# Altium project AD7763EDZ_Rev_15.PrjPcb (part 1 of 2)
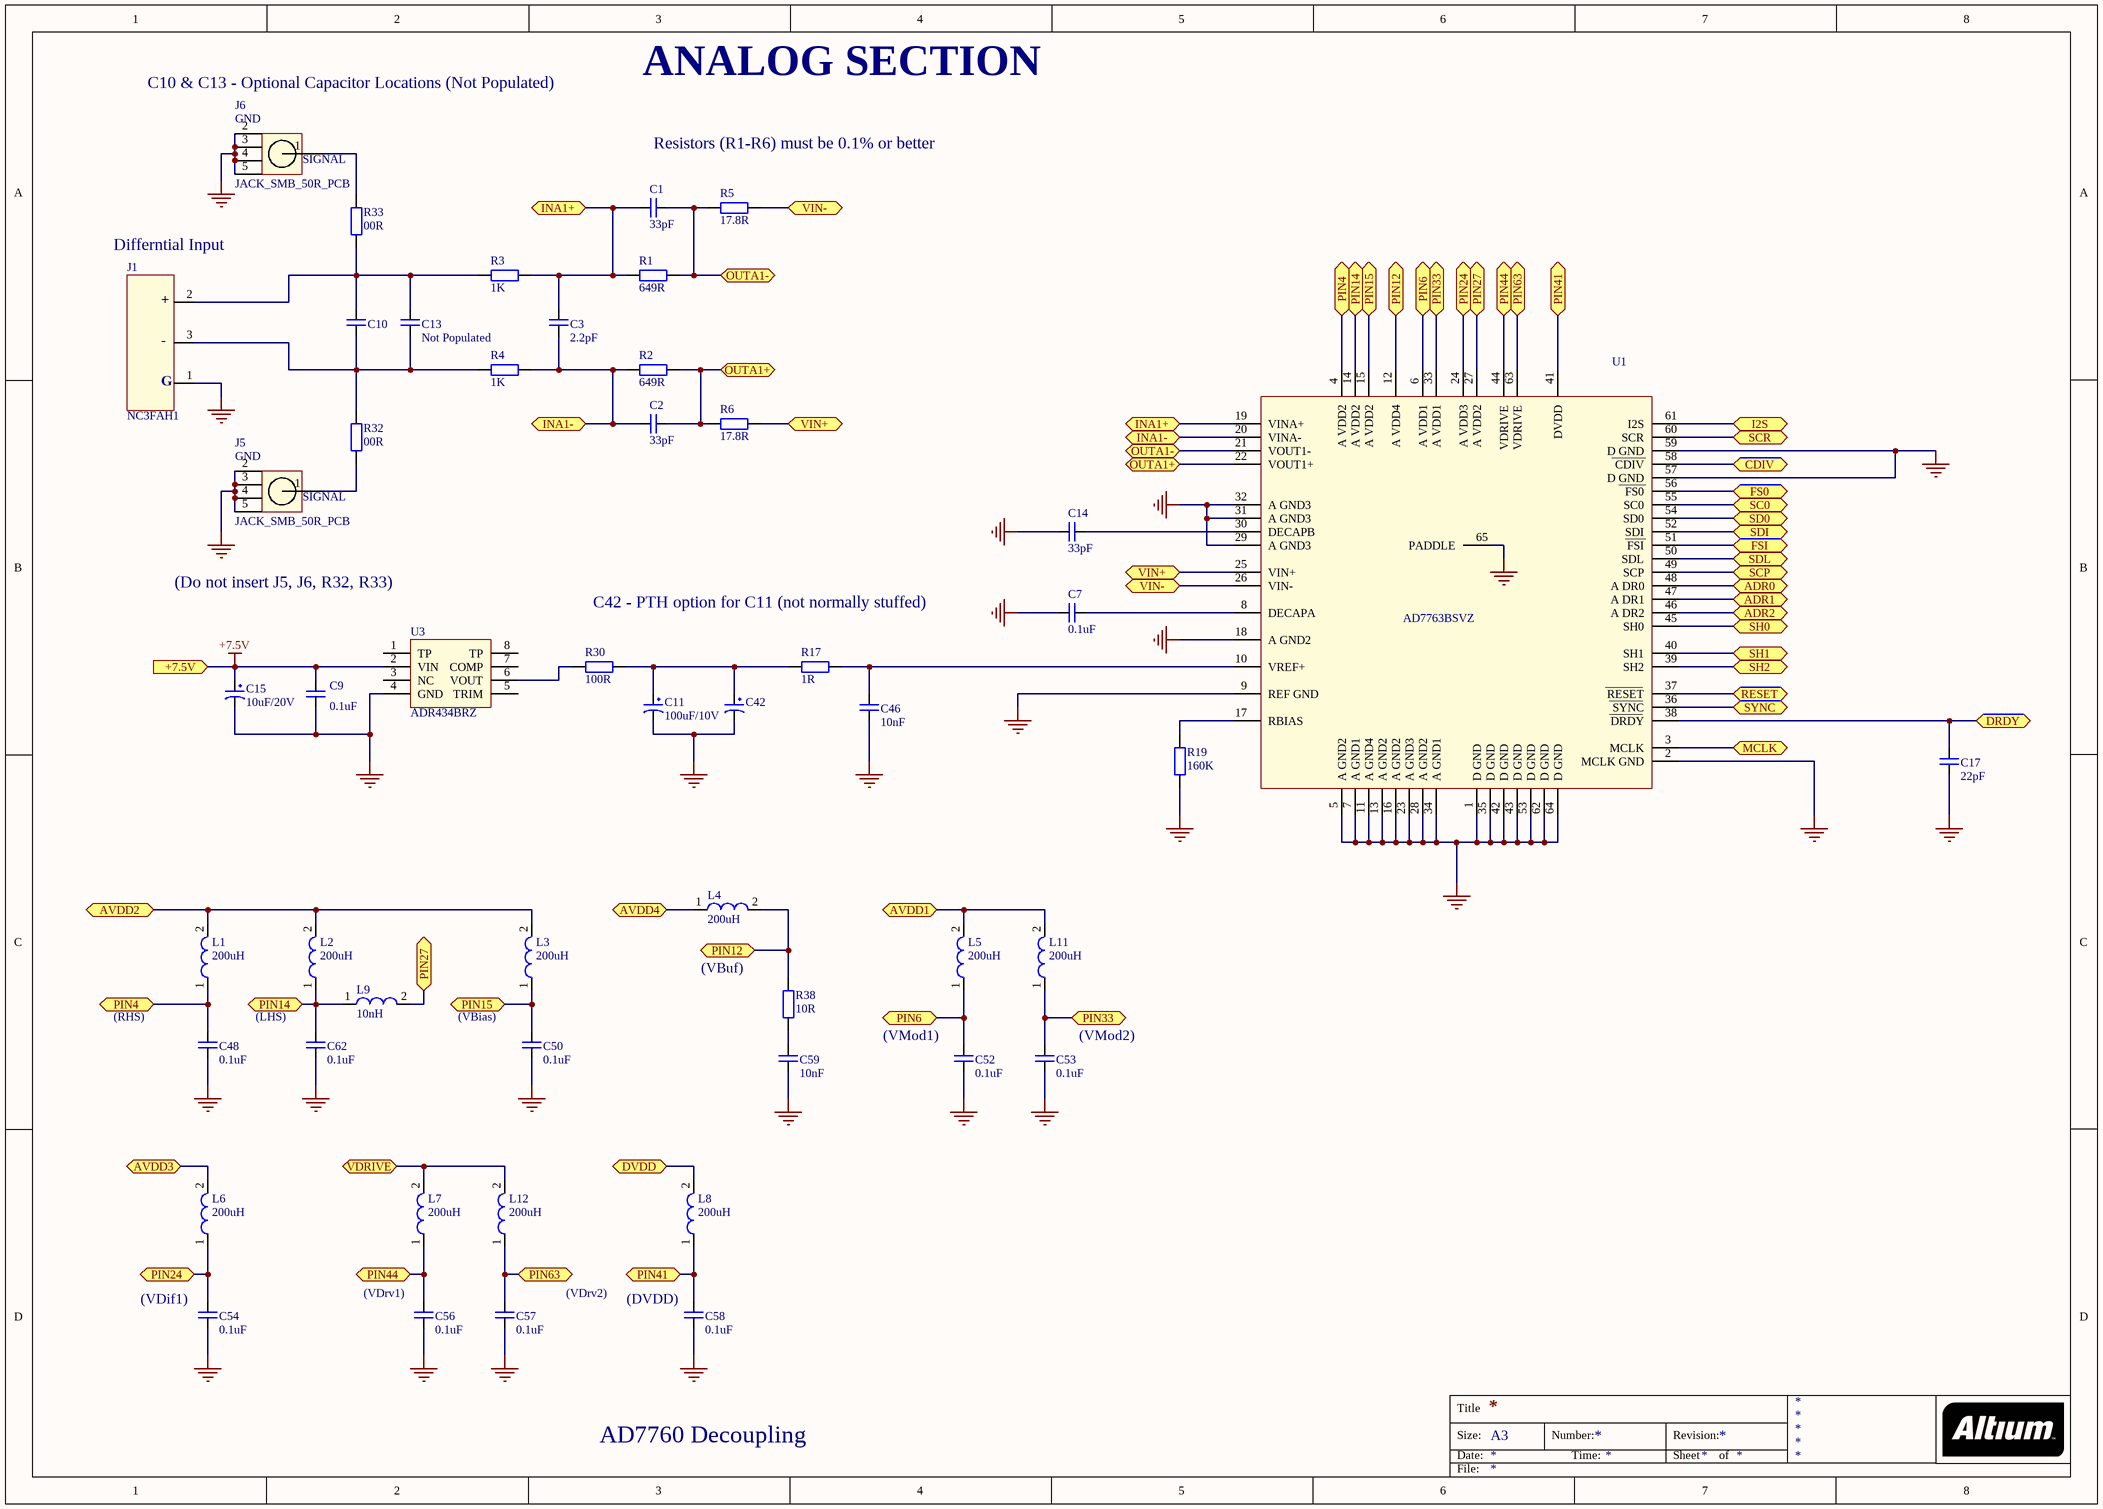
[diagram p0: Analog Section.SchDoc]
3 sheets, 175 parts. Net scope: flat (ports and power ports of the same name join across sheets).
Board file: AD7763EDZ_Rev_15.PcbDoc
Sheets:
  Analog Section.SchDoc
  Power Supply Section.SchDoc
  Interface Section.SchDoc

## Sheet Analog Section.SchDoc
size A3

### Parts
C1  33pF  [C0603]
C2  33pF  [C0603]
C3  2.2pF  [C0603]
C7  0.1uF  [C_0603]
C9  0.1uF  [C0603]
C10  (no value)  [C_0805]
C11  100uF/10V  [C_TANTA_TAJ-C]
C13  Not Populated  [Capacitor Locations]
C14  33pF  [C0603]
C15  10uF/20V  [C_TANTA_TAJ-B]
C17  22pF  [C0603]
C42  100uF/10V  [C_PTH_TANTA_TAJ-C]  (value not drawn)
C46  10nF  [C_0402]
C48  0.1uF  [C_0603]
C50  0.1uF  [C_0603]
C52  0.1uF  [C_0603]
C53  0.1uF  [C_0603]
C54  0.1uF  [C_0603]
C56  0.1uF  [C0603]
C57  0.1uF  [C_0603]
C58  0.1uF  [C0603]
C59  10nF  [C_0603]
C62  0.1uF  [C0603]
J1  NC3FAH1  [NC3FAH1_Audio]
J5  JACK_SMB_50R_PCB  [SMB Jack Radial]
J6  JACK_SMB_50R_PCB  [SMB Jack Radial]
L1  200uH  [IND_0603]
L2  200uH  [IND_0603]
L3  200uH  [IND_0603]
L4  200uH  [IND_0603]
L5  200uH  [IND_0603]
L6  200uH  [IND_0603]
L7  200uH  [IND_0603]
L8  200uH  [IND_0603]
L9  10nH  [IND_0603]
L11  200uH  [IND_0603]
L12  200uH  [IND_0603]
R1  649R  [R_0603]
R2  649R  [R_0603]
R3  1K  [R_0603]
R4  1K  [R_0603]
R5  17.8R  [R_0603]
R6  17.8R  [R_0603]
R17  1R  [R_0603]
R19  160K  [R_0603]
R30  100R  [R_0603]
R32  00R  [R_0603]
R33  00R  [R_0603]
R38  10R  [R_0603]
U1  AD7763BSVZ  [TQFP-64]
U3  ADR434BRZ  [SOIC-8]

### Ports
+7.5V (in), ADR0 (bidir), ADR1 (bidir), ADR2 (bidir), AVDD1 (bidir), AVDD2 (bidir), AVDD3 (bidir), AVDD4 (bidir), CDIV (bidir), DRDY (bidir), DVDD (bidir), FS0 (bidir), FSI (bidir), I2S (bidir), INA1+ (bidir), INA1- (bidir), MCLK (bidir), OUTA1+ (bidir), OUTA1- (bidir), PIN4 (bidir), PIN6 (bidir), PIN12 (bidir), PIN14 (bidir), PIN15 (bidir), PIN24 (bidir), PIN27 (bidir), PIN33 (bidir), PIN41 (bidir), PIN44 (bidir), PIN63 (bidir), RESET (bidir), SC0 (bidir), SCP (bidir), SCR (bidir), SD0 (bidir), SDI (bidir), SDL (bidir), SH0 (bidir), SH1 (bidir), SH2 (bidir), SYNC (bidir), VDRIVE (bidir), VIN+ (bidir), VIN- (bidir)

### Nets
+7.5V: C9.1 C15.1 U3.2(VIN) ; port +7.5V
J3_3: C7.1 C9.2 C11.2 C14.1 C15.2 C17.2 C42.2 C46.2 C48.2 C50.2 C52.2 C53.2 C54.2 C56.2 C57.2 C58.2 C59.2 C62.2 J1.1(G) J5.2 J5.3 J5.4 J5.5 J6.2 J6.3 J6.4 J6.5 R19.1 U1.1(D_GND) U1.2(MCLK_GND) U1.5(A_GND2) U1.7(A_GND1) U1.9(REF_GND) U1.11(A_GND4) U1.13(A_GND2) U1.16(A_GND2) U1.18(A_GND2) U1.23(A_GND3) U1.28(A_GND2) U1.29(A_GND3) U1.31(A_GND3) U1.32(A_GND3) U1.34(A_GND1) U1.35(D_GND) U1.42(D_GND) U1.43(D_GND) U1.53(D_GND) U1.57(D_GND) U1.59(D_GND) U1.62(D_GND) U1.64(D_GND) U1.65(PADDLE) U3.4(GND)
J3_11: U1.51(FSI) ; port FSI
J3_14: U1.52(SDI) ; port SDI
J3_28: C17.1 U1.38(DRDY) ; port DRDY
NetADR0_1: U1.48(A_DR0) ; port ADR0
NetADR1_1: U1.47(A_DR1) ; port ADR1
NetADR2_1: U1.46(A_DR2) ; port ADR2
NetAVDD1_1: L5.2 L11.2 ; port AVDD1
NetAVDD2_1: L1.2 L2.2 L3.2 ; port AVDD2
NetAVDD3_1: L6.2 ; port AVDD3
NetAVDD4_1: L4.1 ; port AVDD4
NetC1_1: C1.1 C3.1 R1.1 R3.2 U1.19(VINA+) ; port INA1+
NetC1_2: C1.2 R1.2 R5.1 U1.21(VOUT1-) ; port OUTA1-
NetC2_1: C2.1 C3.2 R2.1 R4.2 U1.20(VINA-) ; port INA1-
NetC2_2: C2.2 R2.2 R6.1 U1.22(VOUT1+) ; port OUTA1+
NetC7_2: C7.2 U1.8(DECAPA)
NetC10_1: C10.1 C13.1 J1.2(+) R3.1 R33.1
NetC10_2: C10.2 C13.2 J1.3(-) R4.1 R32.2
NetC11_1: C11.1 C42.1 R17.1 R30.2
NetC14_2: C14.2 U1.30(DECAPB)
NetC46_1: C46.1 R17.2 U1.10(VREF+)
NetC48_1: C48.1 L1.1 U1.4(A_VDD2) ; port PIN4
NetC50_1: C50.1 L3.1 U1.15(A_VDD2) ; port PIN15
NetC52_1: C52.1 L5.1 U1.6(A_VDD1) ; port PIN6
NetC53_1: C53.1 L11.1 U1.33(A_VDD1) ; port PIN33
NetC54_1: C54.1 L6.1 U1.24(A_VDD3) ; port PIN24
NetC56_1: C56.1 L7.1 U1.44(VDRIVE) ; port PIN44
NetC57_1: C57.1 L12.1 U1.63(VDRIVE) ; port PIN63
NetC58_1: C58.1 L8.1 U1.41(DVDD) ; port PIN41
NetC59_1: C59.1 R38.1
NetC62_1: C62.1 L2.1 L9.1 U1.14(A_VDD2) ; port PIN14
NetCDIV_1: U1.58(CDIV) ; port CDIV
NetDVDD_1: L8.2 ; port DVDD
NetF2_3: L7.2 L12.2 ; port VDRIVE
NetI2S_1: U1.61(I2S) ; port I2S
NetJ5_1: J5.1 R32.1
NetJ6_1: J6.1 R33.2
NetL4_2: L4.2 R38.2 U1.12(A_VDD4) ; port PIN12
NetL9_2: L9.2 U1.27(A_VDD2) ; port PIN27
NetMCLK_1: U1.3(MCLK) ; port MCLK
NetR5_2: R5.2 U1.26(VIN-) ; port VIN-
NetR6_2: R6.2 U1.25(VIN+) ; port VIN+
NetR7_1: U1.39(SH2) ; port SH2
NetR8_1: U1.45(SH0) ; port SH0
NetR13_1: U1.40(SH1) ; port SH1
NetR19_2: R19.2 U1.17(RBIAS)
NetR20_1: U1.49(SCP) ; port SCP
NetR24_2: U1.36(SYNC) ; port SYNC
NetR30_1: R30.1 U3.6(VOUT)
NetR40_1: U1.60(SCR) ; port SCR
NetRESET_1: U1.37(RESET) ; port RESET
NetSDL_1: U1.50(SDL) ; port SDL
NetU1_54: U1.54(SD0) ; port SD0
NetU1_55: U1.55(SC0) ; port SC0
NetU1_56: U1.56(FS0) ; port FS0

Not connected (* = marked no-connect by the designer): U3 1(TP) 3(NC) 5(TRIM) 7(COMP) 8(TP)

### Notes on the sheet
- (near J6) C10 & C13 - Optional Capacitor Locations (Not Populated)
- ANALOG SECTION
- Resistors (R1-R6) must be 0.1% or better
- Differntial Input
- (Do not insert J5, J6, R32, R33)
- C42 - PTH option for C11 (not normally stuffed)
- (VBuf)
- (RHS)
- (LHS)
- (VBias)
- (near C52) (VMod1)
- (near C53) (VMod2)
- (near C54) (VDif1)
- (near C56) (VDrv1)
- (near C57) (VDrv2)
- (near C58) (DVDD)
- AD7760 Decoupling
- Title
- Size:
- Date:
- A3
- Number:
- Time:
- Revision:
- Sheet
- of
- File:
- (in symbol JACK_SMB_50R_PCB) GND; SIGNAL

### Library data of the parts
C1 C2 C14 = C_0603_33pF: CAP CER 33PF 50V 5% NP0 0603; Manufacturer: AVX Corporation; Manufacturer Part Number: 06035A330JAT2A; Value: 33pF/25V; Temperature Coefficient: C0G, NP0; Supplier 1: Digi-Key; RoHS: RoHS Compliant; Category: Capacitors; Stock 1: 36000; Pricing 1: 4000=0.01265, 8000=0.01155, 12000=0.011, 28000=0.01045, 100000=0.00756 (USD); Packaging: Tape & Reel (TR); Capacitance: 33pF; Tolerance: ±5%; Voltage - Rated: 50V; Mounting Type: Surface Mount, MLCC; Operating Temperature: -55°C ~ 125°C; Applications: General Purpose; Ratings: -; Package / Case: 0603 (1608 Metric); Size / Dimension: 0.063" L x 0.032" W (1.60mm x 0.81mm); Height - Seated (Max): -; Thickness (Max): 0.035" (0.90mm); Lead Spacing: -; Features: -; Lead Style: -; ComponentLink1URL: http://www.avx.com/docs/Catalogs/ccog.pdf; ComponentLink1Description: http://www.avx.com/docs/Catalogs/ccog.pdf; Supplier Part Number 1: 478-1169-2-ND
C3 = C_0603_2.2pF: CAP CER 2.2PF 50V NP0 0603; Manufacturer: AVX Corporation; Manufacturer Part Number: 06035A2R2CAT2A; Value: 2.2pF/50V; Tolerance: ±0.25pF; Temperature Coefficient: C0G, NP0; Supplier 1: Digi-Key; RoHS: RoHS Compliant; Category: Capacitors; Stock 1: 8000; Pricing 1: 4000=0.038, 8000=0.0361, 12000=0.0342, 28000=0.0323, 100000=0.02565 (USD); Packaging: Tape & Reel (TR); Capacitance: 2.2pF; Voltage - Rated: 50V; Mounting Type: Surface Mount, MLCC; Operating Temperature: -55°C ~ 125°C; Applications: General Purpose; Ratings: -; Package / Case: 0603 (1608 Metric); Size / Dimension: 0.063" L x 0.032" W (1.60mm x 0.81mm); Height - Seated (Max): -; Thickness (Max): 0.035" (0.90mm); Lead Spacing: -; Features: -; Lead Style: -; ComponentLink1URL: http://www.avx.com/docs/Catalogs/ccog.pdf; ComponentLink1Description: http://www.avx.com/docs/Catalogs/ccog.pdf; Supplier Part Number 1: 478-1155-2-ND
C7 C48 C50 C52-C54 C57 = C_0.1uF_0402: CAP CER 0.1UF 16V Y5V 0402; Manufacturer: Yageo; Manufacturer Part Number: CC0402ZRY5V7BB104; Value: 0.1uF/16V; Capacitance: 0.1µF; Tolerance: -20%, +80%; Temperature Coefficient: Y5V (F); Supplier 1: Digi-Key; RoHS: RoHS Compliant; Category: Capacitors; Stock 1: 2610000; Pricing 1: 10000=0.00214, 20000=0.00204, 30000=0.00194, 50000=0.00173, 100000=0.0014 (USD); Packaging: Tape & Reel (TR); Voltage - Rated: 16V; Mounting Type: Surface Mount, MLCC; Operating Temperature: -30°C ~ 85°C; Applications: General Purpose; Ratings: -; Package / Case: 0402 (1005 Metric); Size / Dimension: 0.039" L x 0.020" W (1.00mm x 0.50mm); Height - Seated (Max): -; Thickness (Max): 0.022" (0.55mm); Lead Spacing: -; Features: -; Lead Style: -; ComponentLink1URL: http://www.yageo.com/documents/recent/UPY-GPHC_Y5V_6.3V-to-50V_5_revised.pdf; ComponentLink1Description: http://www.yageo.com/documents/recent/UPY-GPHC_Y5V_6.3V-to-50V_5_revised.pdf; Supplier Part Number 1: 311-1047-2-ND
C9 C56 C58 C62 = C_0.1uF_0603: Ceramic Capacitor, 0.1 µF, ± 10%, X7R, 16 V, 0603; Manufacturer: MULTICOMP; Manufacturer Part Number: MCB0603R104KCT; Value: 0.1uF/16V; Supplier 1: Farnell; RoHS: YES; Stock 1: 797824; Pricing 1: 10=0.0551, 100=0.0404, 500=0.0279, 1000=0.0189, 4000=0.0141, 8000=0.0131 (GBP); ComponentLink1URL: http://www.farnell.com/datasheets/1723231.pdf; ComponentLink1Description: http://www.farnell.com/datasheets/1723231.pdf; ComponentLink2URL: http://www.farnell.com/cad/1558882.zip; ComponentLink2Description: http://www.farnell.com/cad/1558882.zip; Supplier Part Number 1: 9406140
C10 C13 = C_0.1uF_0805: CAP CER 0.1UF 50V 10% X7R 0805; Manufacturer: MULTICOMP; Manufacturer Part Number: MCU0805R104KCT; Value: 0.1uF/50V; Voltage - Rated: 50V; Supplier 1: Farnell; RoHS: YES; Stock 1: 722514; Pricing 1: 10=0.0642, 100=0.0449, 500=0.0323, 1000=0.0219, 4000=0.0174, 8000=0.014 (GBP); ComponentLink1URL: http://www.farnell.com/datasheets/1859359.pdf; ComponentLink1Description: http://www.farnell.com/datasheets/1859359.pdf; ComponentLink2URL: http://www.farnell.com/cad/1559055.zip; ComponentLink2Description: http://www.farnell.com/cad/1559055.zip; Supplier Part Number 1: 9406387
C11 C42 = C_TANTA_100uF_10V: CAP TANT 100UF 10V 10% 2312_TAJ-C; Manufacturer: AVX Corporation; Manufacturer Part Number: TAJC107K010RNJ; Manufacturer Size Code: C; Capacitance: 100µF; ESR (Equivalent Series Resistance): 1.2 Ohm; Type: Molded; Value: 100uF/10V; Supplier 1: Digi-Key; RoHS: RoHS Compliant; Category: Capacitors; Stock 1: 5000; Pricing 1: 500=0.425, 1000=0.375, 2500=0.35, 5000=0.3375, 12500=0.31875, 25000=0.3125, 50000=0.31 (USD); Packaging: Tape & Reel (TR); Tolerance: ±10%; Voltage - Rated: 10V; Operating Temperature: -55°C ~ 125°C; Mounting Type: Surface Mount; Package / Case: 2312 (6032 Metric); Size / Dimension: 0.236" L x 0.126" W (6.00mm x 3.20mm); Height - Seated (Max): 0.110" (2.80mm); Lead Spacing: -; Features: General Purpose; Lifetime @ Temp.: -; ComponentLink1URL: http://www.avx.com/docs/Catalogs/taj.pdf; ComponentLink1Description: http://www.avx.com/docs/Catalogs/taj.pdf; Supplier Part Number 1: 478-1704-2-ND
C15 = C_TANTA_10uF_20V: CAP TANT 10UF 20V 10% 1210; Manufacturer: AVX Corporation; Manufacturer Part Number: TAJB106K020RNJ; Manufacturer Size Code: B; Capacitance: 10µF; ESR (Equivalent Series Resistance): 2.1 Ohm; Type: Molded; Value: 10uF/20V; Supplier 1: Digi-Key; RoHS: RoHS Compliant; Category: Capacitors; Stock 1: 78000; Pricing 1: 2000=0.16, 4000=0.15, 10000=0.14, 14000=0.1375, 50000=0.13, 100000=0.125 (USD); Packaging: Tape & Reel (TR); Tolerance: ±10%; Voltage - Rated: 20V; Operating Temperature: -55°C ~ 125°C; Mounting Type: Surface Mount; Package / Case: 1210 (3528 Metric); Size / Dimension: 0.138" L x 0.110" W (3.50mm x 2.80mm); Height - Seated (Max): 0.083" (2.10mm); Lead Spacing: -; Features: General Purpose; Lifetime @ Temp.: -; ComponentLink1URL: http://www.avx.com/docs/Catalogs/taj.pdf; ComponentLink1Description: http://www.avx.com/docs/Catalogs/taj.pdf; Supplier Part Number 1: 478-1674-2-ND
C17 = C_22pF_0603: CAP CER 22PF 50V 5% NP0 0402; Manufacturer: Murata Electronics North America; Manufacturer Part Number: GRM1555C1H220JZ01D; Value: 22pF/50V; Temperature Coefficient: C0G, NP0; Supplier 1: Digi-Key; RoHS: RoHS Compliant; Category: Capacitors; Stock 1: 0; Pricing 1: 10000=0 (USD); Packaging: Tape & Reel (TR); Capacitance: 22pF; Tolerance: ±5%; Voltage - Rated: 50V; Mounting Type: Surface Mount, MLCC; Operating Temperature: -55°C ~ 125°C; Applications: General Purpose; Ratings: -; Package / Case: 0402 (1005 Metric); Size / Dimension: 0.039" L x 0.020" W (1.00mm x 0.50mm); Height - Seated (Max): -; Thickness (Max): 0.022" (0.55mm); Lead Spacing: -; Features: -; Lead Style: -; ComponentLink1URL: http://www.murata.com/~/media/webrenewal/support/library/catalog/products/capacitor/mlcc/c02e.ashx; ComponentLink1Description: http://www.murata.com/~/media/webrenewal/support/library/catalog/products/capacitor/mlcc/c02e.ashx; Supplier Part Number 1: 490-1283-2-ND
C46 = C_10nF_0402: Cap Ceramic 0.01uF 16V X7R 10% SMD 0402; Manufacturer: AVX; Manufacturer Part Number: CM05X7R103K16AH; Value: 10nF/16V; Supplier 1: Farnell; RoHS: YES; Pricing 1: 10=0.037, 100=0.031, 500=0.026, 1000=0.025, 3000=0.023, 5000=0.019 (GBP); ComponentLink1URL: http://www.farnell.com/datasheets/24415.pdf; ComponentLink1Description: http://www.farnell.com/datasheets/24415.pdf; Supplier Part Number 1: 1216548
C59 = C_10nF_0603: CAP CER 10000PF 25V 10% X7R 0603; Manufacturer: AVX Corporation; Manufacturer Part Number: 06033C103KAT2A; Value: 10nF/25V; Supplier 1: Digi-Key; RoHS: RoHS Compliant; Category: Capacitors; Stock 1: 32000; Pricing 1: 4000=0.038, 8000=0.0361, 12000=0.0342, 28000=0.0323, 100000=0.02565 (USD); Packaging: Tape & Reel (TR); Capacitance: 10000pF; Tolerance: ±10%; Voltage - Rated: 25V; Temperature Coefficient: X7R; Mounting Type: Surface Mount, MLCC; Operating Temperature: -55°C ~ 125°C; Applications: General Purpose; Ratings: -; Package / Case: 0603 (1608 Metric); Size / Dimension: 0.063" L x 0.032" W (1.60mm x 0.81mm); Height - Seated (Max): -; Thickness (Max): 0.035" (0.90mm); Lead Spacing: -; Features: -; Lead Style: -; ComponentLink1URL: http://www.avx.com/docs/Catalogs/cx7r.pdf; ComponentLink1Description: http://www.avx.com/docs/Catalogs/cx7r.pdf; Supplier Part Number 1: 478-7902-2-ND
J1 = XLR_Female: XLR Female Audio Connector NC3FAH1-1; Manufacturer: Neutrik; Current Rating: 6 A; Number of Positions: 3 Position; Voltage Rating: 50 V; Supplier 1: Mouser; Manufacturer Part Number: NC3FAH1; RoHS: RoHS Compliant; Category: XLR Connectors; Stock 1: 4906; Pricing 1: 1=2.12, 10=2.03, 25=1.96, 50=1.92, 100=1.89, 200=1.86, 500=1.69 (AUD); Color: Black; Contact Plating: Gold; Gender: Female; Orientation: Horizontal; Series: A; Termination Style: Solder; Brand: Neutrik; Contact Material: Bronze; Mounting Style: PCB; Product Category: XLR Panel Mount Connectors; Product Type: Connectors; Standard: Standard XLR; Standard Pack Qty: 20; RoHS - Mouser: Y; Minimum Order Quantity: 1; Reeling: False; ComponentLink1URL: http://www.neutrik.us/en-us/xlr/a-series/nc3fah1; ComponentLink1Description: http://www.neutrik.us/en-us/xlr/a-series/nc3fah1; Supplier 2: Farnell; Stock 2: 134; Pricing 2: 1=1.06, 10=0.936, 50=0.878, 100=0.85, 500=0.778 (GBP); ComponentLink2URL: http://www.farnell.com/datasheets/1088398.pdf; ComponentLink2Description: http://www.farnell.com/datasheets/1088398.pdf; ComponentLink3URL: http://www.farnell.com/cad/1731543.pdf; ComponentLink3Description: http://www.farnell.com/cad/1731543.pdf; ComponentLink4URL: http://www.farnell.com/datasheets/1731542.pdf; ComponentLink4Description: http://www.farnell.com/datasheets/1731542.pdf; Supplier Part Number 1: 568-NC3FAH1; Supplier Part Number 2: 724518
J5 J6 = JACK_SMB_50R_PCB: CONN SMB JACK STR 50 OHM PCB; Manufacturer: RADIALL; Manufacturer Part Number: R114426000; Connector Type: SMB Coaxial; Connector Body Style: Straight Jack; Coaxial Termination: Solder; Impedance: 50; Frequency Max: 4; Body Plating: Gold; Connector Mounting Orientation: PC Board; Insulation Resistance: 1000; No. of Mating Cycles: 500; Withstand Voltage: 700; Supplier 1: Farnell; RoHS: YES; Stock 1: 4581; Pricing 1: 1=2.13, 10=1.85, 25=1.8, 50=1.34 (GBP); Coaxial Cable Types: -; Contact Material: Beryllium Copper; Contact Plating: Gold; Connector Mounting: PCB; Material: Brass; Mounting Type: PCB Through Hole; Operating Frequency Max: 4; Operating Temperature Max: 165; Operating Temperature Min: -65; Termination Method: Solder; Voltage Rating V AC: 500; ComponentLink1URL: http://www.farnell.com/datasheets/32183.pdf; ComponentLink1Description: http://www.farnell.com/datasheets/32183.pdf; ComponentLink2URL: http://www.farnell.com/datasheets/302770.pdf; ComponentLink2Description: http://www.farnell.com/datasheets/302770.pdf; ComponentLink3URL: http://www.farnell.com/datasheets/302211.pdf; ComponentLink3Description: http://www.farnell.com/datasheets/302211.pdf; Supplier Part Number 1: 4194512
L1-L8 L11 L12 = FERRITE_BEAT_200uH: FERRITE BEAD 1000 OHM 0.2A 0603; Manufacturer: Wurth Electronics Inc; Manufacturer Part Number: 74279266; Impedance @ Frequency: 1 kOhm @ 100MHz; Current Rating: 200mA; DC Resistance (DCR): 600 mOhm Max; Filter Type: Differential Mode - Single; Supplier 1: Digi-Key; RoHS: RoHS Compliant; Category: Filters; Stock 1: 36000; Pricing 1: 4000=0.1275 (USD); Packaging: Tape & Reel (TR); Package / Case: 0603 (1608 Metric); Mounting Type: Surface Mount; Height (Max): 0.039" (1.00mm); Size / Dimension: 0.063" L x 0.031" W (1.60mm x 0.80mm); ComponentLink1URL: http://katalog.we-online.de/pbs/datasheet/74279266.pdf; ComponentLink1Description: http://katalog.we-online.de/pbs/datasheet/74279266.pdf; Supplier Part Number 1: 732-4484-2-ND; Value: 200uH
L9 = FERRITE_BEAT_10nH: FIXED IND 10NH 600MA 200 MOHM; Manufacturer: EPCOS (TDK); Manufacturer Part Number: B82496C3100J; Type: Wirewound; Material - Core: Ceramic; Tolerance: ±5%; Shielding: Unshielded; DC Resistance (DCR): 200 mOhm Max; Q @ Freq: 14 @ 100MHz; Frequency - Self Resonant: 5GHz; Frequency - Test: 100MHz; Supplier 1: Digi-Key; RoHS: RoHS Compliant; Category: Inductors, Coils, Chokes; Stock 1: 9348; Pricing 1: 1=0.4, 10=0.356, 100=0.2571, 500=0.22546, 1000=0.18195 (USD); Packaging: Cut Tape (CT); Inductance: 10nH; Current Rating: 600mA; Current - Saturation: -; Operating Temperature: -; Mounting Type: Surface Mount; Package / Case: 0603 (1608 Metric); Size / Dimension: 0.063" L x 0.031" W (1.60mm x 0.80mm); Height - Seated (Max): 0.035" (0.90mm); Supplier Device Package: 0603 (1608 Metric); ComponentLink1URL: http://en.tdk.eu/inf/30/db/ind_2008/b82496c.pdf; ComponentLink1Description: http://en.tdk.eu/inf/30/db/ind_2008/b82496c.pdf; Supplier Part Number 1: 495-1824-1-ND
R1 R2 = R_0603_649R: RES SMD 649 OHM 0.1% 1/16W 0603; Manufacturer: TE Connectivity AMP Connectors; Manufacturer Part Number: 3-1614354-7; Value: 649R/0.1W; Resistance (Ohms): 649; Power (Watts): 0.063W, 1/16W; Temperature Coefficient: ±10ppm/°C; Supplier 1: Digi-Key; RoHS: RoHS Compliant; Category: Resistors; Stock 1: 0; Pricing 1: 250=0.92896 (USD); Packaging: Bulk; Tolerance: ±0.1%; Composition: Thin Film; Features: -; Operating Temperature: -55°C ~ 125°C; Package / Case: 0603 (1608 Metric); Supplier Device Package: 0603; Size / Dimension: 0.061" L x 0.031" W (1.55mm x 0.80mm); Height: 0.022" (0.55mm); Number of Terminations: 2; ComponentLink1URL: http://www.te.com/commerce/DocumentDelivery/DDEController?Action=srchrtrv&DocNm=1773270&DocType=DS&DocLang=English; ComponentLink1Description: http://www.te.com/commerce/DocumentDelivery/DDEController?Action=srchrtrv&DocNm=1773270&DocType=DS&DocLang=English; Supplier Part Number 1: 3-1614354-7-ND
R3 R4 = R_0603_1K: RES SMD 1K OHM 0.1% 1/16W 0603; Manufacturer: TE Connectivity AMP Connectors; Manufacturer Part Number: 1-1614351-9; Value: 1K-1/16W; Power (Watts): 0.063W, 1/16W; Temperature Coefficient: ±10ppm/°C; Supplier 1: Digi-Key; RoHS: RoHS Compliant; Category: Resistors; Stock 1: 0; Pricing 1: 1=1.21, 10=1.01, 100=0.918, 250=0.752, 500=0.742, 1000=0.67, 2000=0.657, 5000=0.6451 (USD); Packaging: Bulk; Resistance (Ohms): 1k; Tolerance: ±0.1%; Composition: Thin Film; Features: -; Operating Temperature: -55°C ~ 125°C; Package / Case: 0603 (1608 Metric); Supplier Device Package: 0603; Size / Dimension: 0.061" L x 0.031" W (1.55mm x 0.80mm); Height: 0.022" (0.55mm); Number of Terminations: 2; ComponentLink1URL: http://www.te.com/commerce/DocumentDelivery/DDEController?Action=srchrtrv&DocNm=1773270&DocType=DS&DocLang=English; ComponentLink1Description: http://www.te.com/commerce/DocumentDelivery/DDEController?Action=srchrtrv&DocNm=1773270&DocType=DS&DocLang=English; Supplier Part Number 1: A105863-ND
R5 R6 = R_0603_17.8R: RES SMD 17.8 OHM 0.1% 1/16W 0603; Manufacturer: TE Connectivity AMP Connectors; Manufacturer Part Number: 6-1614350-6; Value: 17.8R-1/16W; Resistance (Ohms): 17.8; Power (Watts): 0.063W, 1/16W; Temperature Coefficient: ±10ppm/°C; Supplier 1: Digi-Key; RoHS: RoHS Compliant; Category: Resistors; Stock 1: 0; Pricing 1: 250=0.92896 (USD); Packaging: Bulk; Tolerance: ±0.1%; Composition: Thin Film; Features: -; Operating Temperature: -55°C ~ 125°C; Package / Case: 0603 (1608 Metric); Supplier Device Package: 0603; Size / Dimension: 0.061" L x 0.031" W (1.55mm x 0.80mm); Height: 0.022" (0.55mm); Number of Terminations: 2; ComponentLink1URL: http://www.te.com/commerce/DocumentDelivery/DDEController?Action=srchrtrv&DocNm=1773270&DocType=DS&DocLang=English; ComponentLink1Description: http://www.te.com/commerce/DocumentDelivery/DDEController?Action=srchrtrv&DocNm=1773270&DocType=DS&DocLang=English; Supplier Part Number 1: 6-1614350-6-ND
R17 = R_0603_1R: RES SMD 1 OHM 1% 1/16W 0603; Manufacturer: MULTICOMP; Manufacturer Part Number: MC0063W060311R0; Value: 1R-1/16W; Product Range: MC Series; Resistance: 1; Power Rating: 63; Voltage Rating: 50; Resistor Case Style: 0603 [1608 Metric]; Temperature Coefficient: ± 400; Resistor Element Material: Thick Film; Resistor Mounting: SMD<!--FANDB--><div class="features-and-benefits-container"><div class="features-and-benefits-description"><span class="features-benefits-value">The Multicomp MC series current sense resistors are thick film chip resistors. The resistance range includes E96 and E24 decade values from 1ohm to 10Mohm.</span></div><div class="features-and-benefits-list"><ul class="features-and-benefits-list-list"><li class="features-and-benefits-list-item">EIA 0402, 0603, 0805, 1206 chip sizes available</li><li class="features-and-benefits-list-item">Small size and low weight</li><li class="features-and-benefits-list-item">Suitable for both wave and reflow soldering</li><li class="features-and-benefits-list-item">Reduction of assembly costs</li><li class="features-and-benefits-list-item">Maximum working voltage of 50V(0402, 0603), 150V(0805), 200V(1206)</li><li class="features-and-benefits-list-item">Available in ±1%, ±2% and ±5% tolerance</li><li class="features-and-benefits-list-item">Power rating of 62.5mW, 100mW and 125mW</li><li class="features-and-benefits-list-item">±400ppm/°C(1ohm to 10ohm), ±200ppm/°C(11ohm to 100ohm), ±100; Supplier 1: Farnell; RoHS: YES; Stock 1: 5771; Pricing 1: 10=0.01, 100=0.009, 500=0.006, 1000=0.004, 2500=0.0025 (GBP); Resistance Tolerance: ± 1%; Packaging: Cut Tape; MSL: -; ComponentLink1URL: http://www.farnell.com/datasheets/1788326.pdf; ComponentLink1Description: http://www.farnell.com/datasheets/1788326.pdf; Supplier Part Number 1: 2141505RL
R19 = R_0603_160K: RES SMD 160K OHM 1% 1/10W 0603; Manufacturer: MULTICOMP; Manufacturer Part Number: MC0063W06031160K; Value: 160K-1/16W; Product Range: MC Series; Resistance: 160; Power Rating: 63; Voltage Rating: 50; Resistor Case Style: 0603 [1608 Metric]; Temperature Coefficient: ± 100; SVHC: No SVHC (17-Dec-2014); Reel Quantity: 5000; Resistor Element Material: Thick Film; Resistor Mounting: SMD<!--FANDB--><div class="features-and-benefits-container"><div class="features-and-benefits-description"><span class="features-benefits-value">The Multicomp MC series current sense resistors are thick film chip resistors. The resistance range includes E96 and E24 decade values from 1ohm to 10Mohm.</span></div><div class="features-and-benefits-list"><ul class="features-and-benefits-list-list"><li class="features-and-benefits-list-item">EIA 0402, 0603, 0805, 1206 chip sizes available</li><li class="features-and-benefits-list-item">Small size and low weight</li><li class="features-and-benefits-list-item">Suitable for both wave and reflow soldering</li><li class="features-and-benefits-list-item">Reduction of assembly costs</li><li class="features-and-benefits-list-item">Maximum working voltage of 50V(0402, 0603), 150V(0805), 200V(1206)</li><li class="features-and-benefits-list-item">Available in ±1%, ±2% and ±5% tolerance</li><li class="features-and-benefits-list-item">Power rating of 62.5mW, 100mW and 125mW</li><li class="features-and-benefits-list-item">±400ppm/°C(1ohm to 10ohm), ±200ppm/°C(11ohm to 100ohm), ±100; Supplier 1: Farnell; RoHS: YES; Stock 1: 134995; Pricing 1: 5000=0.002, 25000=0.0016, 50000=0.001 (GBP); Resistance Tolerance: ± 1%; Packaging: Full Reel; MSL: -; ComponentLink1URL: http://www.farnell.com/datasheets/1788326.pdf; ComponentLink1Description: http://www.farnell.com/datasheets/1788326.pdf; ComponentLink2URL: http://www.farnell.com/datasheets/1944283.pdf; ComponentLink2Description: http://www.farnell.com/datasheets/1944283.pdf; Supplier Part Number 1: 2131035
R30 = R_0603_100R: RES SMD 100 OHM 1% 1/16W 0603; Manufacturer: MULTICOMP; Manufacturer Part Number: MC0063W06031100R; Value: 100R-1/16W; Product Range: MC Series; Resistance: 100; Power Rating: 63; Voltage Rating: 50; Resistor Case Style: 0603 [1608 Metric]; Temperature Coefficient: ± 200; SVHC: No SVHC (15-Jun-2015); External Depth: 0.45; External Length / Height: 1.6; External Width: 0.8; No. of Pins: 2; Reel Quantity: 5000; Resistor Element Material: Thick Film; Temperature Coeff. +: 200; Voltage Rating V DC: 50V<!--FANDB--><div class="features-and-benefits-container"><div class="features-and-benefits-description"><span class="features-benefits-value">The Multicomp MC series current sense resistors are thick film chip resistors. The resistance range includes E96 and E24 decade values from 1ohm to 10Mohm.</span></div><div class="features-and-benefits-list"><ul class="features-and-benefits-list-list"><li class="features-and-benefits-list-item">EIA 0402, 0603, 0805, 1206 chip sizes available</li><li class="features-and-benefits-list-item">Small size and low weight</li><li class="features-and-benefits-list-item">Suitable for both wave and reflow soldering</li><li class="features-and-benefits-list-item">Reduction of assembly costs</li><li class="features-and-benefits-list-item">Maximum working voltage of 50V(0402, 0603), 150V(0805), 200V(1206)</li><li class="features-and-benefits-list-item">Available in ±1%, ±2% and ±5% tolerance</li><li class="features-and-benefits-list-item">Power rating of 62.5mW, 100mW and 125mW</li><li class="features-and-benefits-list-item">±400ppm/°C(1ohm to 10ohm), ±200ppm/°C(11ohm to 100ohm), ±100; Supplier 1: Farnell; RoHS: Y-EX; Stock 1: 47733; Pricing 1: 10=0.0063, 100=0.006, 500=0.005, 1000=0.004, 2500=0.0023 (GBP); Resistance Tolerance: ± 1%; Packaging: Cut Tape; MSL: -; Operating Temperature Max: 155; Operating Temperature Min: -55; Operating Temperature Range: -55°C to +155; Resistor Mounting: SMD; Tape Width: 8; Temperature Coeff. -: 200; Tolerance +: 1%; Tolerance -: 1%; ComponentLink1URL: http://www.farnell.com/datasheets/1788326.pdf; ComponentLink1Description: http://www.farnell.com/datasheets/1788326.pdf; ComponentLink2URL: http://www.farnell.com/cad/1561149.zip; ComponentLink2Description: http://www.farnell.com/cad/1561149.zip; Supplier Part Number 1: 9330364RL
R32 R33 = R_0603_00R: RES SMD 0.0 OHM JUMPER 1/16W; Manufacturer: TE Connectivity AMP Connectors; Manufacturer Part Number: 6-1622826-4; Value: 0R-1/16W; Resistance (Ohms): 0.0; Power (Watts): 0.063W, 1/16W; Supplier 1: Digi-Key; RoHS: RoHS Compliant; Category: Resistors; Stock 1: 80000; Pricing 1: 10000=0.00112, 30000=0.00099, 50000=0.0009, 100000=0.00089 (USD); Packaging: Tape & Reel (TR); Tolerance: Jumper; Composition: Thick Film; Features: -; Temperature Coefficient: -; Operating Temperature: -55°C ~ 125°C; Package / Case: 0402 (1005 Metric); Supplier Device Package: 0402; Size / Dimension: 0.039" L x 0.020" W (1.00mm x 0.50mm); Height: 0.016" (0.40mm); Number of Terminations: 2; ComponentLink1URL: http://www.te.com/commerce/DocumentDelivery/DDEController?Action=srchrtrv&DocNm=1773204&DocType=DS&DocLang=English; ComponentLink1Description: http://www.te.com/commerce/DocumentDelivery/DDEController?Action=srchrtrv&DocNm=1773204&DocType=DS&DocLang=English; Supplier Part Number 1: A106025TR-ND
R38 = R_0603_10R: RES SMD 10R OHM 1% 1/16W 0603; Manufacturer: MULTICOMP; Manufacturer Part Number: MC0063W0603110R; Value: 10R-1/16W; Product Range: MC Series; Resistance: 10; Power Rating: 63; Voltage Rating: 50; Resistor Case Style: 0603 [1608 Metric]; Temperature Coefficient: ± 400; SVHC: No SVHC (15-Jun-2015); External Depth: 0.45; External Length / Height: 1.6; External Width: 0.8; No. of Pins: 2; Reel Quantity: 5000; Resistor Element Material: Thick Film; Temperature Coeff. +: 200; Voltage Rating V DC: 50V<!--FANDB--><div class="features-and-benefits-container"><div class="features-and-benefits-description"><span class="features-benefits-value">The Multicomp MC series current sense resistors are thick film chip resistors. The resistance range includes E96 and E24 decade values from 1ohm to 10Mohm.</span></div><div class="features-and-benefits-list"><ul class="features-and-benefits-list-list"><li class="features-and-benefits-list-item">EIA 0402, 0603, 0805, 1206 chip sizes available</li><li class="features-and-benefits-list-item">Small size and low weight</li><li class="features-and-benefits-list-item">Suitable for both wave and reflow soldering</li><li class="features-and-benefits-list-item">Reduction of assembly costs</li><li class="features-and-benefits-list-item">Maximum working voltage of 50V(0402, 0603), 150V(0805), 200V(1206)</li><li class="features-and-benefits-list-item">Available in ±1%, ±2% and ±5% tolerance</li><li class="features-and-benefits-list-item">Power rating of 62.5mW, 100mW and 125mW</li><li class="features-and-benefits-list-item">±400ppm/°C(1ohm to 10ohm), ±200ppm/°C(11ohm to 100ohm), ±100; Supplier 1: Farnell; RoHS: Y-EX; Stock 1: 12643; Pricing 1: 10=0.01, 100=0.0083, 500=0.0067, 1000=0.005, 2500=0.0025 (GBP); Resistance Tolerance: ± 1%; Packaging: Cut Tape; MSL: -; Operating Temperature Max: 155; Operating Temperature Min: -55; Operating Temperature Range: -55°C to +155; Resistor Mounting: SMD; Tape Width: 8; Temperature Coeff. -: 200; Tolerance +: 1%; Tolerance -: 1%; ComponentLink1URL: http://www.farnell.com/datasheets/1788326.pdf; ComponentLink1Description: http://www.farnell.com/datasheets/1788326.pdf; ComponentLink2URL: http://www.farnell.com/cad/1561151.zip; ComponentLink2Description: http://www.farnell.com/cad/1561151.zip; Supplier Part Number 1: 9330429
U1 = AD7763BSVZ: IC ADC 24BIT SRL 625KSPS 64TQFP; Manufacturer: Analog Devices Inc; Number of Bits: 24; Sampling Rate (Per Second): 625k; Number of Inputs: 1; Input Type: Differential; Data Interface: I²S; Architecture: Sigma-Delta; Reference Type: External; Voltage - Supply, Analog: 2.5V, 3.15 V ~ 5.25 V; Voltage - Supply, Digital: 2.5V; Supplier 1: Digi-Key; Manufacturer Part Number: AD7763BSVZ; RoHS: RoHS Compliant; Category: Integrated Circuits (ICs); Stock 1: 169; Pricing 1: 1=35.92, 10=33.593, 100=29.127, 250=27.1852, 500=25.82594, 1000=24.85504, 2500=24.528 (USD); Packaging: Tray; Configuration: ADC; Ratio - S/H:ADC: -; Number of A/D Converters: 1; Features: -; Operating Temperature: -40°C ~ 85°C; Package / Case: 64-TQFP Exposed Pad; Supplier Device Package: 64-TQFP-EP (10x10); ComponentLink1URL: http://www.analog.com/media/en/technical-documentation/data-sheets/AD7763.pdf; ComponentLink1Description: http://www.analog.com/media/en/technical-documentation/data-sheets/AD7763.pdf; Supplier Part Number 1: AD7763BSVZ-ND
U3 = ADR434BRZ: IC VREF SERIES 4.096V 8SOIC; Manufacturer: Analog Devices Inc; Output Type: Fixed; Current - Output: 30mA; Tolerance: ±0.04%; Temperature Coefficient: 3ppm/°C; Noise - 0.1Hz to 10Hz: 6.25µVp-p; Voltage - Input: 6.1 V ~ 18 V; Current - Supply: 800µA; Supplier 1: Digi-Key; Manufacturer Part Number: ADR434BRZ; RoHS: RoHS Compliant; Category: Integrated Circuits (ICs); Stock 1: 223; Pricing 1: 1=9.79, 10=8.807, 98=8.02367, 196=7.24092, 294=6.65381, 588=6.0667, 1078=5.2839, 2548=5.0882, 5096=4.944 (USD); Packaging: Tube; Reference Type: Series; Voltage - Output (Min/Fixed): 4.096V; Voltage - Output (Max): -; Noise - 10Hz to 10kHz: -; Current - Cathode: -; Operating Temperature: -40°C ~ 125°C (TA); Mounting Type: Surface Mount; Package / Case: 8-SOIC (0.154", 3.90mm Width); Supplier Device Package: 8-SOIC; ComponentLink1URL: http://www.analog.com/media/en/technical-documentation/data-sheets/ADR430_431_433_434_435.pdf; ComponentLink1Description: http://www.analog.com/media/en/technical-documentation/data-sheets/ADR430_431_433_434_435.pdf; Supplier Part Number 1: ADR434BRZ-ND